# Altium project WRIP.PrjPcb
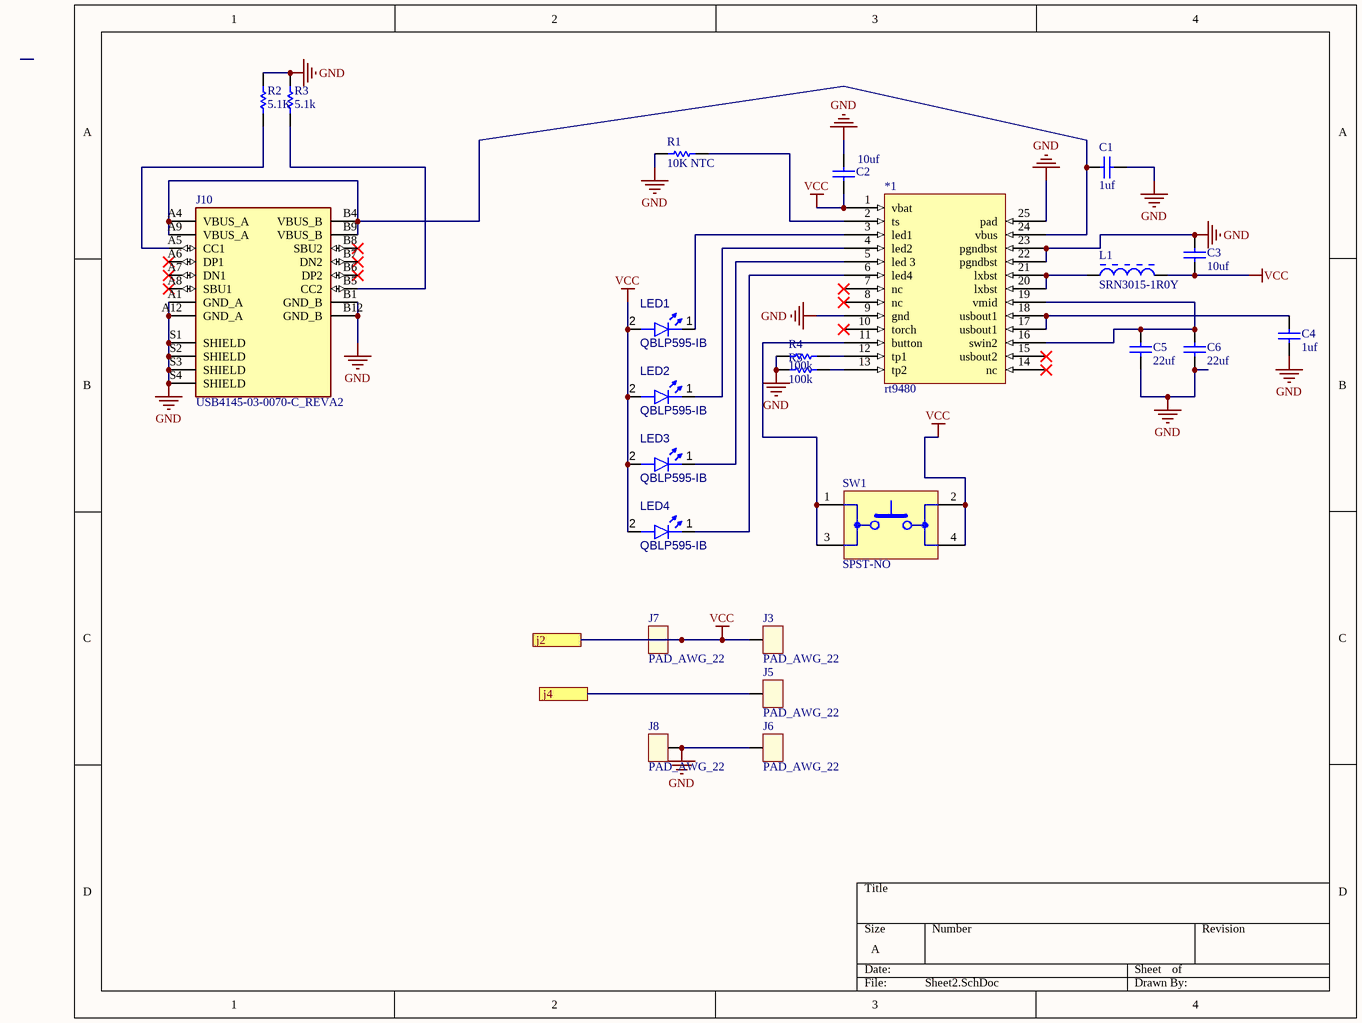
[diagram p0: Sheet2.SchDoc]
1 sheet, 24 parts. Net scope: flat (ports and power ports of the same name join across sheets).
Board files: WRIP.PcbDoc, WRIP(1).PcbDoc, WRIP-ELECTRONICS usb.PcbDoc, WRIP-ELECTRONICS usb(1).PcbDoc

## Sheet Sheet2.SchDoc
size A

### Parts
*1  rt9480  [QFN50P400X400X80_HS-25N]
C1  value 1uf  [C0201]  (hidden comment: Capacitor)
C2  value 10uf  [C0201]  (hidden comment: Capacitor)
C3  value 10uf  [C0201]  (hidden comment: Capacitor)
C4  value 1uf  [C0201]  (hidden comment: Capacitor)
C5  value 22uf  [C0201]  (hidden comment: Capacitor)
C6  value 22uf  [C0201]  (hidden comment: Capacitor)
J3  PAD_AWG_22  [PAD_0.4X0.6]  (no BOM)
J5  PAD_AWG_22  [PAD_0.4X0.6]  (no BOM)
J6  PAD_AWG_22  [PAD_0.4X0.6]  (no BOM)
J7  PAD_AWG_22  [PAD_0.4X0.6]  (no BOM)
J8  PAD_AWG_22  [PAD_0.4X0.6]  (no BOM)
J10  USB4145-03-0070-C_REVA2  [GCT_USB4145-03-0070-C_REVA2]
L1  SRN3015-1R0Y  [BOUR-SRN3015-2_V]
LED1  QBLP595-IB  [QTB-QBLP595_V]
LED2  QBLP595-IB  [QTB-QBLP595_V]
LED3  QBLP595-IB  [QTB-QBLP595_V]
LED4  QBLP595-IB  [QTB-QBLP595_V]
R1  10K NTC  [RESC1005X40X25LL05T10]
R2  value 5.1K  [R0201]  (hidden comment: Resistor)
R3  value 5.1k  [R0201]  (hidden comment: Resistor)
R4  value 100k  [R0201]  (hidden comment: Resistor)
R5  value 100k  [R0201]  (hidden comment: Resistor)
SW1  SPST-NO  [EVPAA802Q]

### Ports
j2, j4

### Nets
GND: *1.9(gnd) *1.22(pgndbst) *1.23(pgndbst) *1.25(pad) C1.2 C2.2 C3.2 C4.1 C5.1 C6.1 J6.1 J8.1 J10.A1(GND_A) J10.A12(GND_A) J10.B1(GND_B) J10.B12(GND_B) J10.S1(SHIELD) J10.S2(SHIELD) J10.S3(SHIELD) J10.S4(SHIELD) R1.2 R2.2 R3.2 R4.1 R5.1
VCC: *1.1(vbat) C2.1 C3.1 J3.1 J7.1 L1.2 LED1.2(A) LED2.2(A) LED3.2(A) LED4.2(A) SW1.2 SW1.4 ; port j2
j4: J5.1 ; port j4
Net*1_2: *1.2(ts) R1.1
Net*1_3: *1.3(led1) LED1.1(K)
Net*1_4: *1.4(led2) LED2.1(K)
Net*1_5: *1.5(led_3) LED3.1(K)
Net*1_6: *1.6(led4) LED4.1(K)
Net*1_11: *1.11(button) SW1.1 SW1.3
Net*1_12: *1.12(tp1) R4.2
Net*1_13: *1.13(tp2) R5.2
Net*1_16: *1.16(swin2) *1.19(vmid) C5.2 C6.2
Net*1_17: *1.17(usbout1) *1.18(usbout1) C4.2
Net*1_20: *1.20(lxbst) *1.21(lxbst) L1.1
Net*1_24: *1.24(vbus) C1.1 J10.A4(VBUS_A) J10.A9(VBUS_A) J10.B4(VBUS_B) J10.B9(VBUS_B)
NetJ10_A5: J10.A5(CC1) R2.1
NetJ10_B5: J10.B5(CC2) R3.1

Not connected (* = marked no-connect by the designer): *1 7(nc)* 8(nc)* 10(torch)* 14(nc)* 15(usbout2)*; J10 A6(DP1)* A7(DN1)* A8(SBU1)* B6(DP2)* B7(DN2)* B8(SBU2)*

### Library data of the parts
*1 = CMP-019-00049-1: power supply lipo
C1-C6 = Capacitor: SimulationGenericComponent: True
J3 J5-J8 = TP_25MILC_1: Pad for solder awg 22 wire
J10 = CMP-007-000000-2: Type C USB 2.0 Connector; MF: Global Connector Technology; Source: USB4145-03-0070-C_REVA2.SchLib; Check_prices: https://www.snapeda.com/parts/USB4145-03-0070-C/Global+Connector+Technology/view-part/?ref=eda; Price: None; MP: USB4145-03-0070-C; Purchase-URL: https://pricing.snapeda.com/search/part/USB4145-03-0070-C/?ref=eda; Availability: In Stock; Value: *; Design Item ID: USB4145-03-0070-C_REVA2; SnapEDA_Link: https://www.snapeda.com/parts/USB4145-03-0070-C/Global+Connector+Technology/view-part/?ref=snap; Component Type: Standard; Pin Count: 20; Package: None
L1 = CMP-0007-00007-1: Semi-shielded Power Inductor, 1 uH, +/- 30%, 2.35 A, -40 to 125 degC, 3 x 3 x 1.5 mm SMD, RoHS and Halogen Free, Tape and Reel; Manufacturer: Bourns; Inductance tolerance: +/- 30%; DCR Max: 0.048 Ohm; Resistance to Solder Heat: +260 degC for 10 sec.; SRF Min: 145 MHz; Inductance: 1 uH; Isat: 2.35 A; ComponentLink3URL: http://www.bourns.com/data/global/pdfs/SRN3015.pdf; Packing: Tape and Reel; ComponentLink1Description: Manufacturer URL; DatasheetVersion: Aug-11; ComponentLink2URL: http://www.bourns.com/data/global/pdfs/SRN3015.pdf; PartNumber: SRN3015-1R0Y; ComponentLink3Description: Package Specification; RoHS: TRUE; Mounting Technology: Surface Mount; ComponentLink1URL: http://www.bourns.com/; Operating Temperature: -40 to 125 degC; Rated current: 2.35 A; PackageDescription: 2-Pin SMD, Body 3 x 3 mm, Height 1.5 mm; ComponentLink2Description: Datasheet; PackageReference: SRN3015
LED1-LED4 = CMP-007-00042-3: Chip LED 0402, Blue, 0.02 A, 3.1 to 3.7 V, -40 to 80 degC, 2-Pin SMD, RoHS, Tape and Reel; RoHS Compliant: Yes; Colour: Blue; Pins: 2; Case/Package: 0402; Mounting Technology: SMT
R1 = CMP-2002-07540-1: Manufacturer: Yageo; Part Number: RC0402FR-0725K5L
R2-R5 = Resistor: TC1: 0; SimulationGenericComponent: True; TC2: 0
SW1 = EVPAA802Q: SWITCH TACTILE SPST-NO 0.02A 15V; Manufacturer: Panasonic; Mechanical Life: 100000Cycles; Actuator Color: Grey; Voltage Rating (DC): 12V; Operating Force: 5N; Current Rating: 50mA; Throw Configuration: SPST; Contact Resistance: 100mR; Illumination Type: Non-Illuminated; Switch Travel: 0.15mm; Switch Function: Off-Mom; Actuator Type: Standard; Actuator Length: 0.3mm; Supplier 1: Digi-Key; Manufacturer Part Number: EVPAA802Q; Stock 1: 0; Pricing 1: 1=0.79, 10=0.762, 25=0.7324, 100=0.6356, 250=0.58, 500=0.5389, 1000=0.4833, 2500=0.454 (USD); Mount: Surface Mount; Case/Package: SMD/SMT; Contact Plating: Silver; Color: Black; Min Operating Temperature: -40°C; Max Operating Temperature: 85°C; Packaging: Tape and Reel; Package Quantity: 1; Max Voltage Rating (DC): 15V; Termination: Gull Wing; Electrical Life: 100000Cycles; Orientation: Straight; Series: EVPAA; Height: 0.7mm; Size: 2.9mm; Radiation Hardening: No; ComponentLink1URL: http://www.mouser.com/ds/2/315/ATK0000PE192-72254.pdf?src-supplier=Mouser; ComponentLink1Description: http://www.mouser.com/ds/2/315/ATK0000PE192-72254.pdf?src-supplier=Mouser; ComponentLink2URL: http://industrial.panasonic.com/www-data/pdf/ATK0000/ATK0000CE26.pdf?src-supplier=Future+Electronics; ComponentLink2Description: http://industrial.panasonic.com/www-data/pdf/ATK0000/ATK0000CE26.pdf?src-supplier=Future+Electronics; ComponentLink3URL: https://industrial.panasonic.com/ac/cdn/e/control/switch/light-touch/catalog/sw_lt_eng_package.pdf?src-supplier=Digi-Key; ComponentLink3Description: https://industrial.panasonic.com/ac/cdn/e/control/switch/light-touch/catalog/sw_lt_eng_package.pdf?src-supplier=Digi-Key; ComponentLink4URL: https://industrial.panasonic.com/ac/cdn/e/control/switch/light-touch/catalog/sw_lt_eng_3529s.pdf?src-supplier=Digi-Key; ComponentLink4Description: https://industrial.panasonic.com/ac/cdn/e/control/switch/light-touch/catalog/sw_lt_eng_3529s.pdf?src-supplier=Digi-Key; Supplier Part Number 1: P15198CT-ND